# EAGLE design Arduino-Pro-v17 (EAGLE 7.7.0)
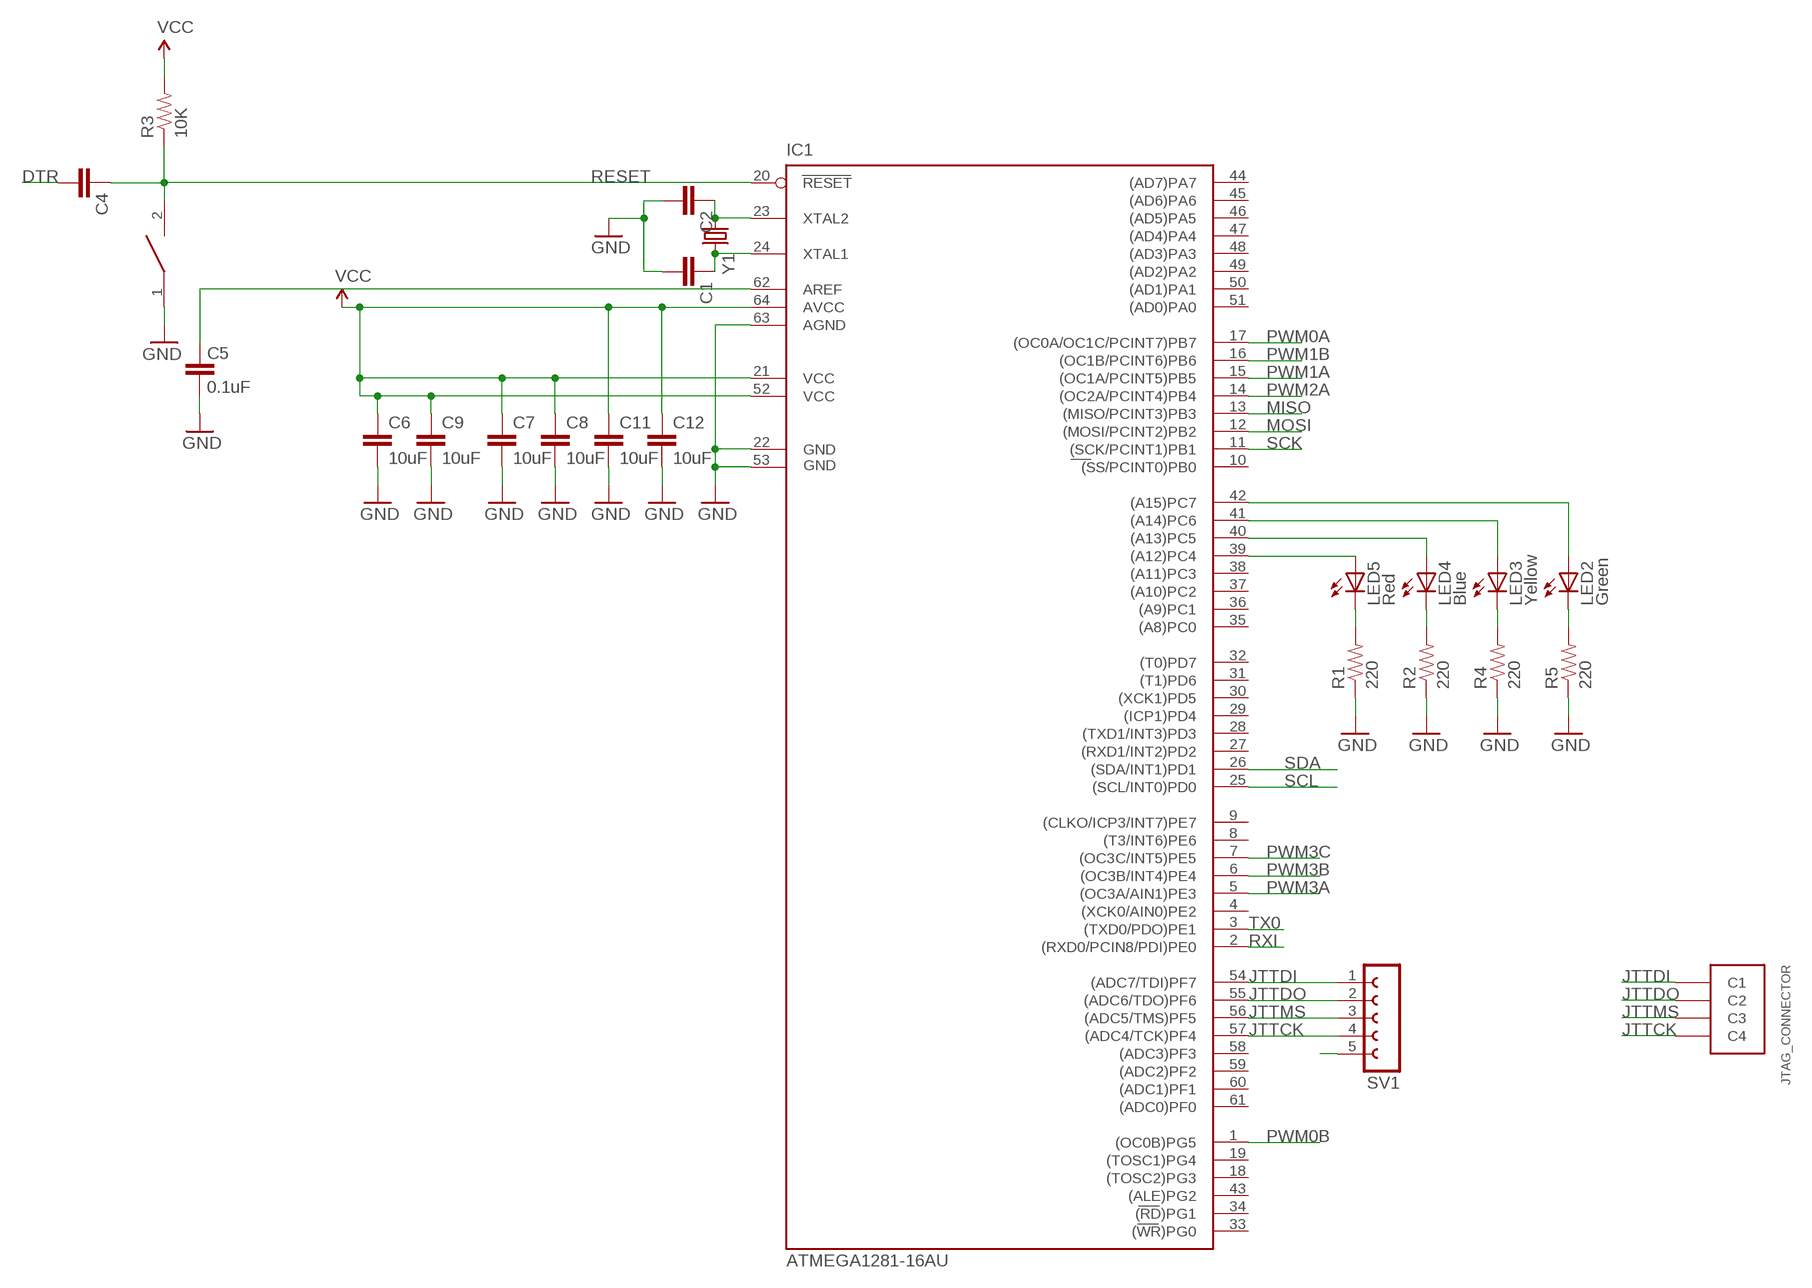
[diagram p0: schematic, sheet 1, part 1 of 2]
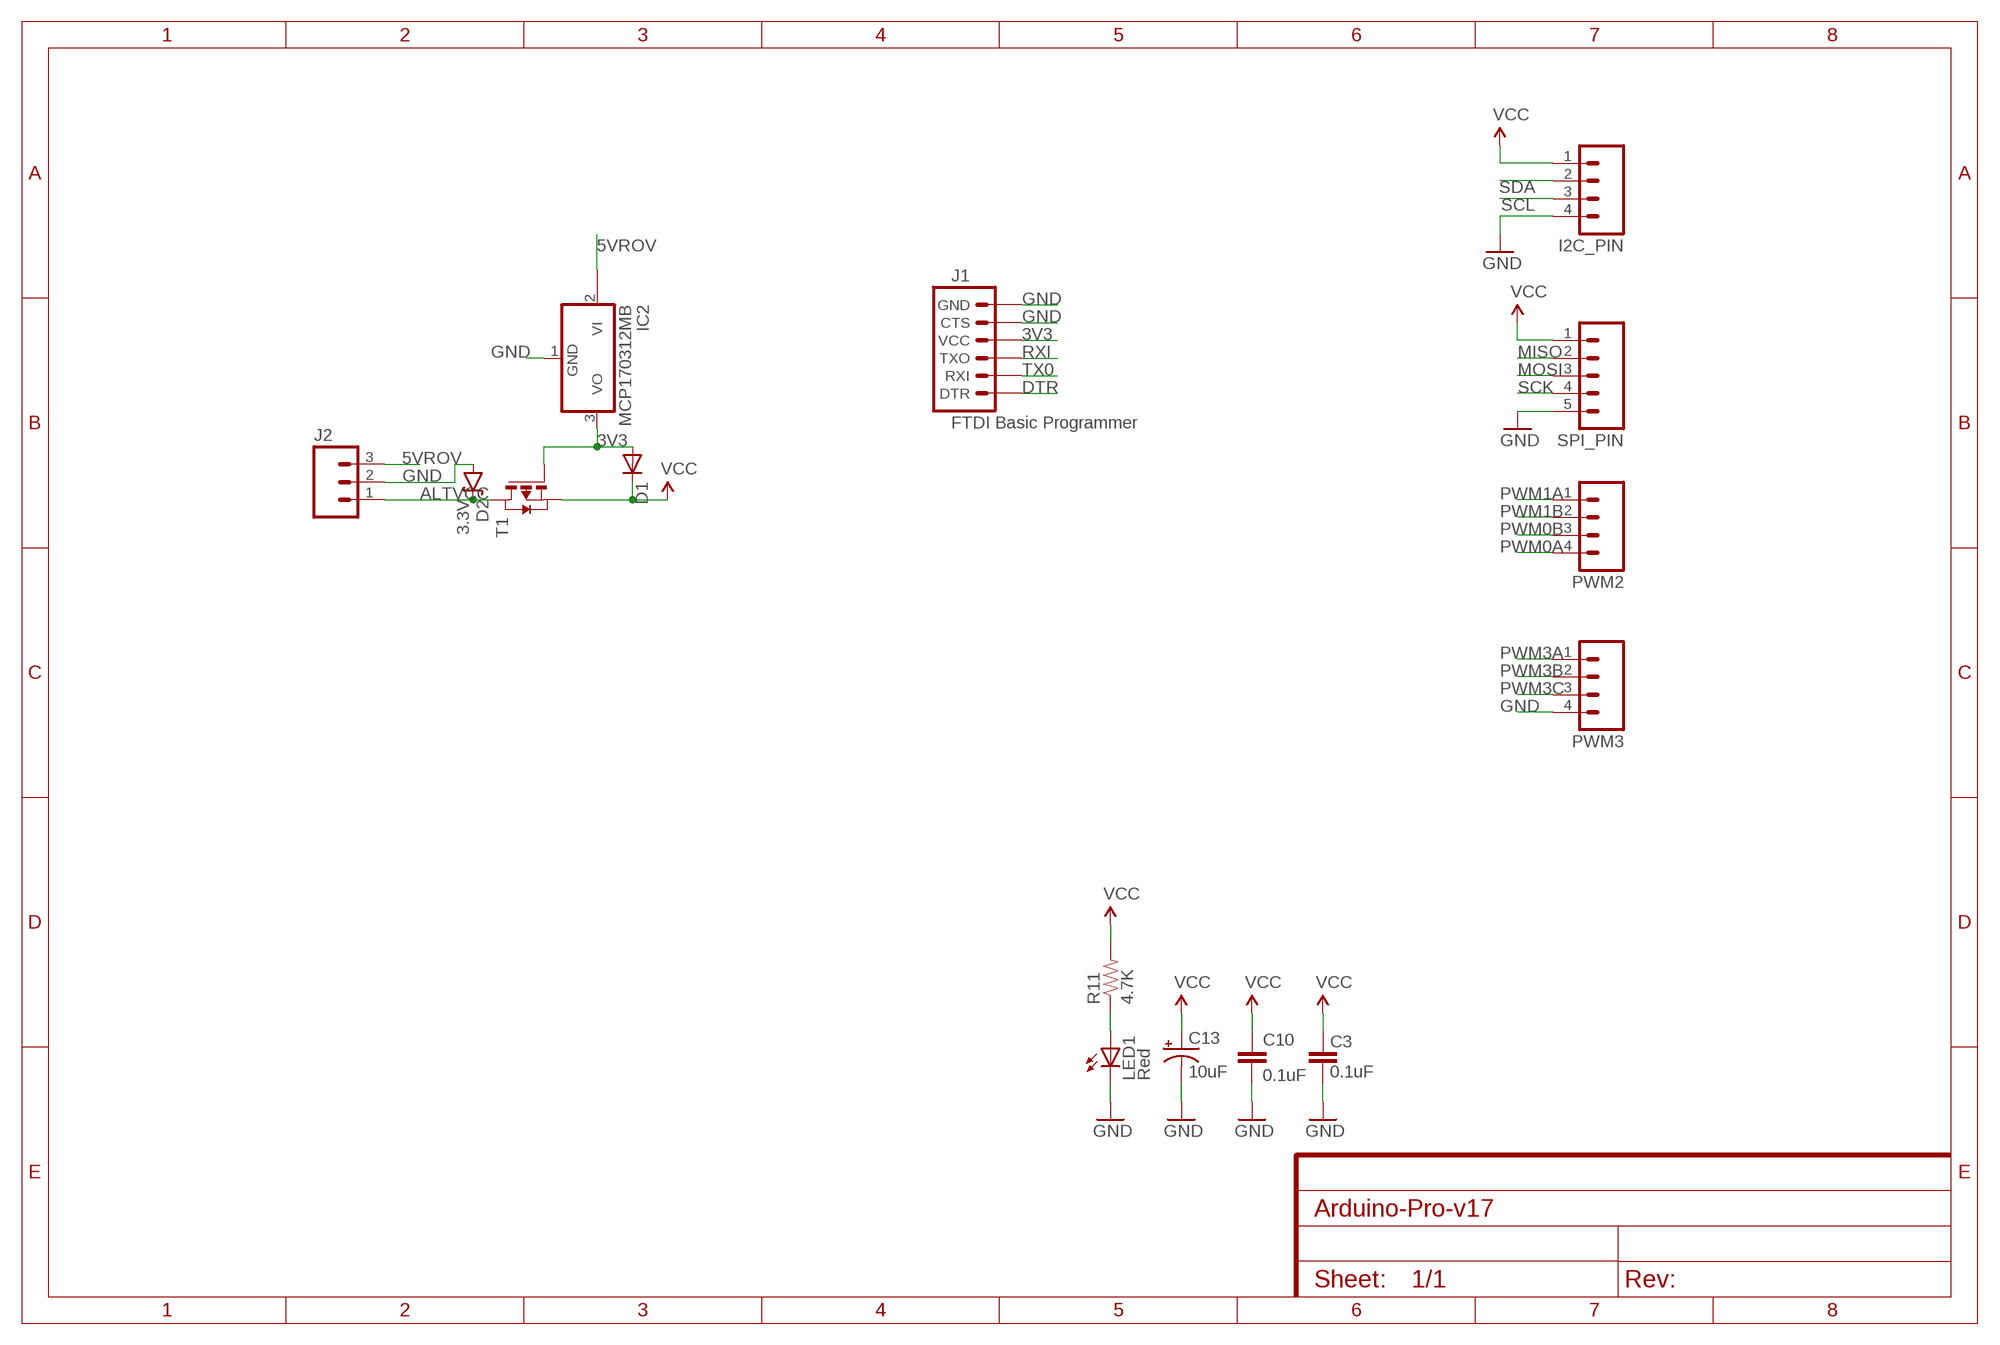
[diagram p1: schematic, sheet 1, part 2 of 2]

## Parts
C1  CAP0603-CAP  [0603-CAP]
C2  CAP0603-CAP  [0603-CAP]
C3  0.1uF  CAP0402-CAP  [0402-CAP]
C4  CAP0603-CAP  [0603-CAP]
C5  0.1uF  CAP0402-CAP  [0402-CAP]
C6  10uF  CAP0603-CAP  [0603-CAP]
C7  10uF  CAP0603-CAP  [0603-CAP]
C8  10uF  CAP0603-CAP  [0603-CAP]
C9  10uF  CAP0603-CAP  [0603-CAP]
C10  0.1uF  CAP0402-CAP  [0402-CAP]
C11  10uF  CAP0603-CAP  [0603-CAP]
C12  10uF  CAP0603-CAP  [0603-CAP]
C13  10uF  CAP_POL1206  [EIA3216]
D1  DIODE-DO-214AC  [DO-214AC]
D2  3.3V  DIODE-ZENER3.3V  [SOD-323]
I2C_PIN  M04PTH  [1X04]
IC1  ATMEGA1281-16AU  [TQFP64]
IC2  MCP170312MB  [SOT89]
J1  FTDI Basic Programmer  ARDUINO_SERIAL_PROGRAMPTH  [1X06]
J2  M03PTH  [1X03]
JTAG_CONNECTOR  MICRO-FIT-4-SMD-PART  [MICRO-FIT-4-SMD]
LED1  Red  LED0603  [LED-0603]
LED2  Green  LED0603  [LED-0603]
LED3  Yellow  LED0603  [LED-0603]
LED4  Blue  LED0603  [LED-0603]
LED5  Red  LED0603  [LED-0603]
PWM2  M04PTH  [1X04]
PWM3  M04PTH  [1X04]
R1  220  RESISTOR0402-RES  [0402-RES]
R2  220  RESISTOR0402-RES  [0402-RES]
R3  10K  RESISTOR0603-RES  [0603-RES]
R4  220  RESISTOR0402-RES  [0402-RES]
R5  220  RESISTOR0402-RES  [0402-RES]
R11  4.7K  RESISTOR0402-RES  [0402-RES]
SPI_PIN  M05PTH  [1X05]
SV1  FE05-1  [FE05-1]
T1  FDN340P  [SOT-23]
U$1  SWITCH  [SW_2512]
Y1  CRYSTALHC49US  [HC49US]

## Nets
3V3: D1.A IC2.3(VO) J1.4(VCC) T1.3(G)
5VROV: IC2.2@1(VI1) J2.3
ALTVCC: D2.C J2.1 T1.1(D)
DTR: C4.2 J1.1(DTR)
GND [vcc]: C1.2 C2.2 C3.1 C5.1 C6.2 C7.2 C8.2 C9.2 C10.2 C11.2 C12.2 C13.C(-) D2.A I2C_PIN.4 IC1.22(GND) IC1.53(GND1) IC1.63(AGND) IC2.1(GND) J1.5(CTS) J1.6(GND) J2.2 LED1.C PWM3.4 R1.1 R2.1 R4.1 R5.1 SPI_PIN.5 SV1.5 U$1.1
JTTCK: IC1.57((ADC4/TCK)PF4) JTAG_CONNECTOR.C4 SV1.4
JTTDI: IC1.54((ADC7/TDI)PF7) JTAG_CONNECTOR.C1 SV1.1
JTTDO: IC1.55((ADC6/TDO)PF6) JTAG_CONNECTOR.C2 SV1.2
JTTMS: IC1.56((ADC5/TMS)PF5) JTAG_CONNECTOR.C3 SV1.3
MISO: IC1.13((MISO/PCINT3)PB3) SPI_PIN.2
MOSI: IC1.12((MOSI/PCINT2)PB2) SPI_PIN.3
N$1: C1.1 IC1.24(XTAL1) Y1.2
N$3: C2.1 IC1.23(XTAL2) Y1.1
N$5: IC1.39((A12)PC4) LED5.A
N$7: C5.2 IC1.62(AREF)
N$9: IC1.40((A13)PC5) LED4.A
N$10: IC1.41((A14)PC6) LED3.A
N$11: IC1.42((A15)PC7) LED2.A
N$14: LED5.C R1.2
N$15: LED4.C R2.2
N$16: LED3.C R4.2
N$22: LED2.C R5.2
N$38: LED1.A R11.1
PWM0A: IC1.17((OC0A/OC1C/PCINT7)PB7) PWM2.4
PWM0B: IC1.1((OC0B)PG5) PWM2.3
PWM1A: IC1.15((OC1A/PCINT5)PB5) PWM2.1
PWM1B: IC1.16((OC1B/PCINT6)PB6) PWM2.2
PWM2A: IC1.14((OC2A/PCINT4)PB4)
PWM3A: IC1.5((OC3A/AIN1)PE3) PWM3.1
PWM3B: IC1.6((OC3B/INT4)PE4) PWM3.2
PWM3C: IC1.7((OC3C/INT5)PE5) PWM3.3
RESET: C4.1 IC1.20(RESET) R3.1 U$1.2
RXI: IC1.2((RXD0/PCIN8/PDI)PE0) J1.3(TXO)
SCK: IC1.11((SCK/PCINT1)PB1) SPI_PIN.4
SCL: I2C_PIN.3 IC1.25((SCL/INT0)PD0)
SDA: I2C_PIN.2 IC1.26((SDA/INT1)PD1)
TX0: IC1.3((TXD0/PDO)PE1) J1.2(RXI)
VCC: C3.2 C6.1 C7.1 C8.1 C9.1 C10.1 C11.1 C12.1 C13.A(+) D1.C I2C_PIN.1 IC1.21(VCC) IC1.52(VCC1) IC1.64(AVCC) R3.2 R11.2 SPI_PIN.1 T1.2(S)
Unconnected: IC1.4((XCK0/AIN0)PE2) IC1.8((T3/INT6)PE6) IC1.9((CLKO/ICP3/INT7)PE7) IC1.10((SS/PCINT0)PB0) IC1.18((TOSC2)PG3) IC1.19((TOSC1)PG4) IC1.27((RXD1/INT2)PD2) IC1.28((TXD1/INT3)PD3) IC1.29((ICP1)PD4) IC1.30((XCK1)PD5) IC1.31((T1)PD6) IC1.32((T0)PD7) IC1.33((WR)PG0) IC1.34((RD)PG1) IC1.35((A8)PC0) IC1.36((A9)PC1) IC1.37((A10)PC2) IC1.38((A11)PC3) IC1.43((ALE)PG2) IC1.44((AD7)PA7) IC1.45((AD6)PA6) IC1.46((AD5)PA5) IC1.47((AD4)PA4) IC1.48((AD3)PA3) IC1.49((AD2)PA2) IC1.50((AD1)PA1) IC1.51((AD0)PA0) IC1.58((ADC3)PF3) IC1.59((ADC2)PF2) IC1.60((ADC1)PF1) IC1.61((ADC0)PF0) IC2.2(VI)

## Library data of the parts
C1 C2 C4 = SparkFun-Capacitors:CAP: Capacitor Standard 0603 ceramic capacitor, and 0.1" leaded capacitor.
C3 C5 C10 = SparkFun:CAP: Capacitor Standard 0603 ceramic capacitor, and 0.1" leaded capacitor.
C6-C9 C11 C12 = SparkFun-Passives:CAP: Capacitor Standard 0603 ceramic capacitor, and 0.1" leaded capacitor.
C13 = SparkFun:CAP_POL: Capacitor Polarized These are standard SMD and PTH capacitors. Normally 10uF, 47uF, and 100uF in electrolytic and tantalum varieties. Always verify the external diameter of the through hole cap, it varies with capacity, voltage, and manufacturer. The EIA devices should be standard.
D1 = DiscreteComponents:DIODE-: DIODE
D2 = SparkFun-DiscreteSemi:DIODE-ZENER: Zener Diode Production Part - 8199 3.4V Zener Voltage; PROD_ID: DIO-11284
I2C_PIN PWM2 PWM3 = SparkFun-Connectors:M04: Header 4 Standard 4-pin 0.1" header. Use with straight break away headers (SKU : PRT-00116), right angle break away headers (PRT-00553), swiss pins (PRT-00743), machine pins (PRT-00117), and female headers (PRT-00115). Molex polarized connector foot print use with SKU : PRT-08231 with associated crimp pins and housings. 1MM SMD Version SKU: PRT-10208; PROD_ID: CONN-09696
IC1 = atmel-2005:ATMEGA1281*: MICROCONTROLLER 128 Kbytes FLASH 4 Kbytes EEPROM 8 Kbytes SRAM 54 General Purpose I/O pins 6-channels 16-bit PWM 2 x Serial USARTs 8-channels 10-bit A/D
IC2 = linear:MCP1703*: 250 mA, 16V, Low Quiescent Current LDO Regulator Source: http://ww1.microchip.com/downloads/en/DeviceDoc/22049b.pdf
J1 = SparkFun-Connectors:ARDUINO_SERIAL_PROGRAM: FTDI connector footprints
J2 = SparkFun-Connectors:M03: Header 3 Standard 3-pin 0.1" header. Use with straight break away headers (SKU : PRT-00116), right angle break away headers (PRT-00553), swiss pins (PRT-00743), machine pins (PRT-00117), and female headers (PRT-00115). Molex polarized connector foot print use with SKU : PRT-08232 with associated crimp pins and housings.
JTAG_CONNECTOR = Connectors:MICRO-FIT-4-SMD: 4 Pin Molex connector; DIGIKEY-CONTACT-PN: WM1125CT-ND; DIGIKEY-FEMALE-PN: WM2640CT-ND; DIGIKEY-MALE-PN: WM1847-ND
LED1-LED5 = SparkFun:LED: LEDs Standard schematic elements and footprints for 5mm, 3mm, 1206, and 0603 sized LEDs. 5mm - Spark Fun Electronics SKU : COM-00529 (and others)
R1 R2 R4 R5 R11 = SparkFun:RESISTOR: Resistor Basic schematic elements and footprints for 0603, 1206, and PTH resistors.
R3 = SparkFun-Passives:RESISTOR: Resistor Basic schematic elements and footprints for 0603, 1206, and PTH resistors.
SPI_PIN = SparkFun-Connectors:M05: Header 5 Standard 5-pin 0.1" header. Use with straight break away headers (SKU : PRT-00116), right angle break away headers (PRT-00553), swiss pins (PRT-00743), machine pins (PRT-00117), and female headers (PRT-00115). Molex polarized connector foot print use with SKU : PRT-08230 with associated crimp pins and housings.
SV1 = con-lsta:FE05-1: FEMALE HEADER; OC_FARNELL: unknown; OC_NEWARK: unknown
T1 = DiscreteComponents:FDN340P: MOS FET; DIGIKEY: FDN340PCT-ND
U$1 = DiscreteComponents:SWITCH
Y1 = SparkFun-FreqCtrl:CRYSTAL: Various standard crystals. Proven footprints.

## Net classes
0 default: width 0.203 mm
1 vcc: width 0.254 mm

## Board
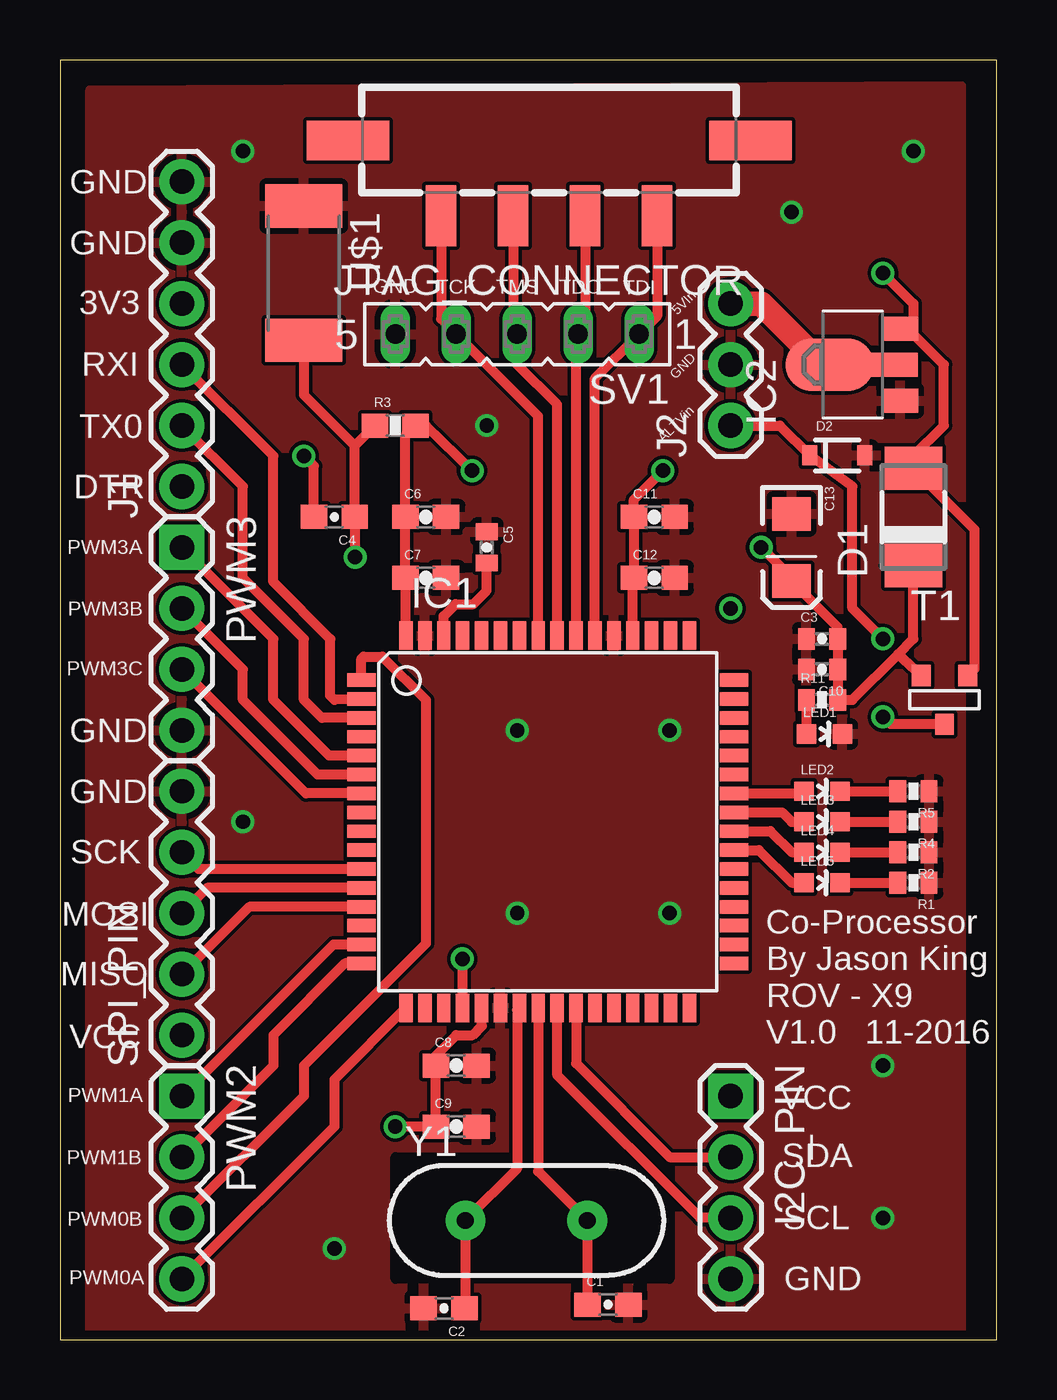
[diagram p2: board, top side]
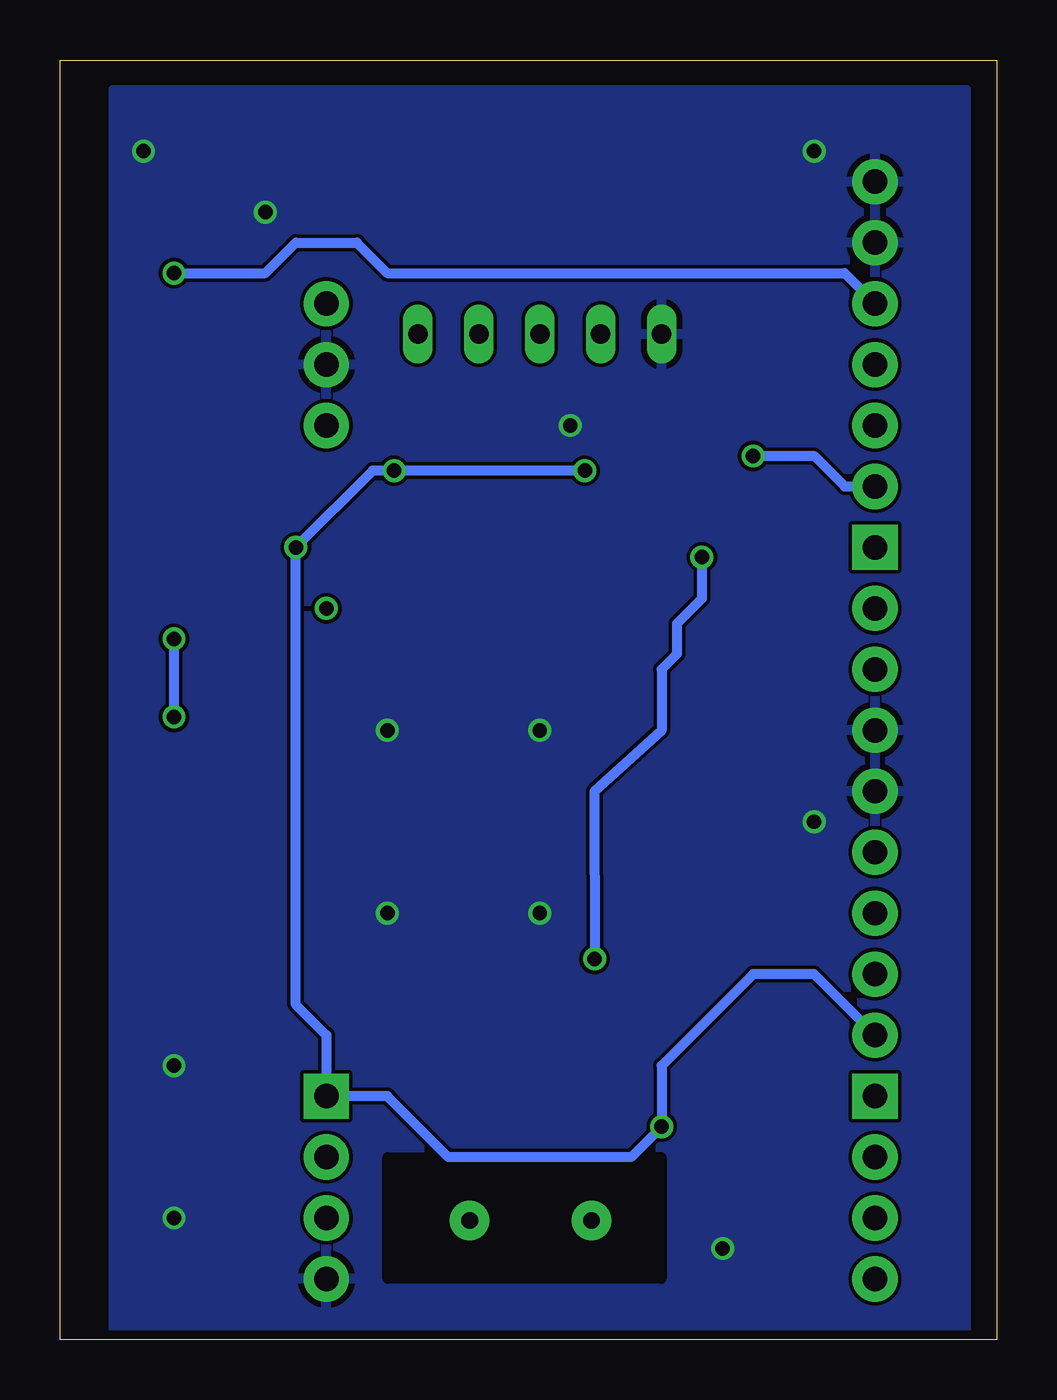
[diagram p3: board, bottom side, seen from below]

Size 39.04 x 53.33 mm. Coordinates in mm from the lower left corner, seen from the top.
Outline: 0,0 39.04,0 39.04,53.33 0,53.33 0,0
Copper layers (1*16): Top 0.0356mm / dielectric 1.5011mm / Bottom 0.0356mm
Design rules "LaenPCBOrder": minimum track width 6mil, minimum drill 13mil, track to track 6mil, track to pad 6mil, pad to pad 6mil, via to via 6mil, smd to smd 6mil, copper to edge 15mil, drill to drill 6mil, minimum pad ring 7mil, minimum via ring 7mil, stop-mask expansion 3mil, vias tented up to drill 0mil, thermal gap 10mil
tRestrict: area 14,2.5 to 25.4,7.6
bRestrict: area 14,2.5 to 25.4,7.6

### Footprints (pad centres in the part's own frame; a part is rotated, then mirrored left to right if it is on the bottom)
0603-CAP = smd 1.1 x 1: 1 -0.85,0; 2 0.85,0
0402-CAP = smd 0.7 x 0.9: 1 -0.65,0; 2 0.65,0
EIA3216 = smd 1.4 x 1.6: A 1.4,0; C -1.4,0
DO-214AC = smd 1.8 x 2.4: A 2.025,0; C -2.025,0
SOD-323 = smd 0.63 x 0.83: A 1.15,0; C -1.15,0
1X04 = drill 1.016 pad 1.88 square: 1 0,0 | drill 1.016 pad 1.88: 2 2.54,0; 3 5.08,0; 4 7.62,0
TQFP64 = smd 1.194 x 0.559: 1 -7.76,5.905; 2 -7.76,5.118; 3 -7.76,4.331; 4 -7.76,3.543; 5 -7.76,2.756; 6 -7.76,1.968; 7 -7.76,1.181; 8 -7.76,0.394; 9 -7.76,-0.394; 10 -7.76,-1.181; 11 -7.76,-1.968; 12 -7.76,-2.756; 13 -7.76,-3.543; 14 -7.76,-4.331; 15 -7.76,-5.118; 16 -7.76,-5.905; 33 7.76,-5.905; 34 7.76,-5.118; 35 7.76,-4.331; 36 7.76,-3.543; 37 7.76,-2.756; 38 7.76,-1.968; 39 7.76,-1.181; 40 7.76,-0.394; 41 7.76,0.394; 42 7.76,1.181; 43 7.76,1.968; 44 7.76,2.756; 45 7.76,3.543; 46 7.76,4.331; 47 7.76,5.118; 48 7.76,5.905 | smd 0.559 x 1.194: 17 -5.905,-7.76; 18 -5.118,-7.76; 19 -4.331,-7.76; 20 -3.543,-7.76; 21 -2.756,-7.76; 22 -1.968,-7.76; 23 -1.181,-7.76; 24 -0.394,-7.76; 25 0.394,-7.76; 26 1.181,-7.76; 27 1.968,-7.76; 28 2.756,-7.76; 29 3.543,-7.76; 30 4.331,-7.76; 31 5.118,-7.76; 32 5.905,-7.76; 49 5.905,7.76; 50 5.118,7.76; 51 4.331,7.76; 52 3.543,7.76; 53 2.756,7.76; 54 1.968,7.76; 55 1.181,7.76; 56 0.394,7.76; 57 -0.394,7.76; 58 -1.181,7.76; 59 -1.968,7.76; 60 -2.756,7.76; 61 -3.543,7.76; 62 -4.331,7.76; 63 -5.118,7.76; 64 -5.905,7.76
SOT89 = smd 1 x 1.5: 1 -1.499,-1.981; 3 1.499,-1.981 | smd 1 x 2: 2 0,-1.727 | smd 2.2 x 3.7: 2@1 0,0.94
1X06 = drill 1.016 pad 1.88: 1 0,0; 2 2.54,0; 3 5.08,0; 4 7.62,0; 5 10.16,0; 6 12.7,0
1X03 = drill 1.016 pad 1.88: 1 0,0; 2 2.54,0; 3 5.08,0
MICRO-FIT-4-SMD = smd 1.27 x 2.54: C1 5.6,3.955; C2 8.6,3.955; C3 11.6,3.955; C4 14.6,3.955 | smd 3.43 x 1.65: NC1 1.715,0.825; NC2 18.485,0.825
LED-0603 = smd 0.8 x 0.8: A 0,-0.75; C 0,0.75
0402-RES = smd 0.7 x 0.9: 1 -0.65,0; 2 0.65,0
0603-RES = smd 1.1 x 1: 1 -0.85,0; 2 0.85,0
1X05 = drill 1.016 pad 1.88: 1 0,0; 2 2.54,0; 3 5.08,0; 4 7.62,0; 5 10.16,0
FE05-1 = drill 0.813 long: 1 -5.08,0; 2 -2.54,0; 3 0,0; 4 2.54,0; 5 5.08,0
SOT-23 = smd 0.787 x 0.889: 1 0.025,-1.016; 2 -0.94,1.016; 3 0.991,1.016
SW_2512 = smd 1.8 x 3.2: 1 -2.8,0; 2 2.8,0
HC49US = drill 0.7 pad 1.651: 1 -2.54,0; 2 2.54,0

### Placement (x,y rotation side)
C1  22.83,1.47 0 top
C2  16,1.32 180 top
C3  31.75,29.21 0 top
C4  11.43,34.29 180 top
C5  17.78,33.02 270 top
C6  15.24,34.29 0 top
C7  15.24,31.75 0 top
C8  16.51,11.43 0 top
C9  16.51,8.89 0 top
C10  31.75,27.94 180 top
C11  24.77,34.29 0 top
C12  24.77,31.75 0 top
C13  30.48,33.02 270 top
D1  35.56,34.29 90 top
D2  32.38,36.86 0 top
I2C_PIN  27.94,10.16 270 top
IC1  20.32,21.59 0 top
IC2  33.02,40.64 90 top
J1  5.08,35.56 90 top
J2  27.94,38.1 90 top
JTAG_CONNECTOR  30.48,50.8 180 top
LED1  31.85,25.25 270 top
LED2  31.75,22.86 270 top
LED3  31.75,21.59 270 top
LED4  31.75,20.32 270 top
LED5  31.75,19.05 270 top
PWM2  5.08,10.16 270 top
PWM3  5.08,33.02 270 top
R1  35.56,19.05 180 top
R2  35.56,20.32 180 top
R3  13.97,38.1 0 top
R4  35.56,21.59 180 top
R5  35.56,22.86 180 top
R11  31.75,26.67 0 top
SPI_PIN  5.08,12.7 90 top
SV1  19.05,41.91 180 top
T1  36.83,26.67 0 top
U$1  10.16,44.45 270 top
Y1  19.43,4.98 0 top

### Tracks (layer width: path | path; a pad name or v marks a point on that pad's centre or on a via)
3V3  (via drill 0.6 pad 0.51)
  Top 0.406: D1.A 35.05,36.31 | 35.56,41.91 36.83,40.64 36.83,38.1 35.56,36.83 D1.A | 35.56,41.91 35.23,41.91 IC2.3 | v34.29,44.45 35.56,43.18 35.56,41.91 | D1.A 38.1,33.78 38.1,27.96 T1.3
  Bottom 0.406: J1.4 6.35,44.45 25.4,44.45 26.67,45.72 29.21,45.72 30.48,44.45 v34.29,44.45
5VROV
  Top 1.016: J2.3 29.21,43.18 31.75,40.64 IC2.2@1 33.02,40.64
ALTVCC  (via drill 0.6 pad 0.51)
  Top 0.406: J2.1 29.99,38.1 D2.C 33.02,35.56 33.02,30.48 v34.29,29.21 | T1.1 34.59,25.65 v34.29,25.96
  Bottom 0.406: v34.29,25.96 v34.29,29.21
DTR  (via drill 0.6 pad 0.51)
  Top 0.406: C4.2 10.58,36.41 v10.16,36.83
  Bottom 0.406: v10.16,36.83 7.62,36.83 6.35,35.56 J1.1
GND  (via drill 0.6 pad 0.51)
  other vias: 19.05,25.4 7.62,21.59 25.4,25.4 34.29,5.08 17.78,38.1 35.56,49.53 30.48,46.99 7.62,49.53 11.43,3.81 34.29,11.43 25.4,17.78 19.05,17.78
  pour Top: 1.27,52.07 37.54,52.25 37.54,0.18 1.27,0
  pour Bottom: 1.27,52.07 36.83,52.07 36.83,0 1.27,0
JTTCK
  Top 0.406: JTAG_CONNECTOR.C4 15.88,42.54 SV1.4 19.93,38.49 IC1.57
JTTDI
  Top 0.406: JTAG_CONNECTOR.C1 24.88,42.66 SV1.1 22.29,40.07 IC1.54
JTTDO
  Top 0.406: JTAG_CONNECTOR.C2 21.88,42.2 SV1.2 21.5,41.82 IC1.55
JTTMS
  Top 0.406: JTAG_CONNECTOR.C3 18.88,42.08 SV1.3 19.05,40.64 20.71,38.98 IC1.56
MISO
  Top 0.406: IC1.13 7.89,18.05 SPI_PIN.2
MOSI
  Top 0.406: IC1.12 6.13,18.83 SPI_PIN.3
N$1
  Top 0.406: IC1.24 19.93,7.02 Y1.2 21.97,1.49 C1.1
N$2  (via drill 0.6 pad 0.51)
  other vias: 27.94,30.48
N$3
  Top 0.406: IC1.23 19.05,13.74 19.05,7.14 Y1.1 16.89,1.36 C2.1
N$5
  Top 0.406: IC1.39 29.12,20.41 30.48,19.05 LED5.A
N$7
  Top 0.406: IC1.62 15.99,30.16 16.48,30.66 17.22,30.66 17.78,31.22 C5.2
N$9
  Top 0.406: IC1.40 29.6,21.2 30.48,20.32 LED4.A
N$10
  Top 0.406: IC1.41 30.09,21.98 30.48,21.59 LED3.A
N$11
  Top 0.406: IC1.42 30.91,22.77 LED2.A
N$14
  Top 0.406: LED5.C R1.2
N$15
  Top 0.406: LED4.C R2.2
N$16
  Top 0.406: LED3.C R4.2
N$22
  Top 0.406: LED2.C R5.2
N$38
  Top 0.406: R11.1 LED1.A
PWM0A
  Top 0.406: IC1.17 11.43,10.85 11.43,8.89 PWM2.4
PWM0B
  Top 0.406: IC1.1 12.56,28.38 12.65,28.47 13.44,28.47 15.24,26.67 15.24,16.51 10.16,11.43 10.16,10.16 PWM2.3
PWM1A
  Top 0.406: IC1.15 11.39,16.47 PWM2.1
PWM1B
  Top 0.406: IC1.16 11.88,15.68 8.89,12.7 8.89,11.43 PWM2.2
PWM3A
  Top 0.406: IC1.5 11.21,24.35 8.89,26.67 8.89,29.21 PWM3.1
PWM3B
  Top 0.406: IC1.6 10.73,23.56 7.62,26.67 7.62,27.94 PWM3.2
PWM3C
  Top 0.406: IC1.7 10.25,22.77 PWM3.3
RESET  (via drill 0.6 pad 0.51)
  Top 0.406: 12.28,37.26 C4.1 12.29,34.28 v12.29,32.61 | 12.28,37.26 R3.1 | U$1.2 10.16,39.38 12.28,37.26 | v16.76,15.88 16.76,13.84 IC1.20
  Bottom 0.406: v16.76,15.88 16.78,22.86 13.97,25.4 13.97,27.94 13.34,28.57 13.34,29.85 12.28,30.9 v12.28,32.6 v12.29,32.61
RXI
  Top 0.406: IC1.2 11.43,26.67 11.25,26.85 11.27,29.2 8.89,31.58 8.89,36.83 J1.3
SCK
  Top 0.406: IC1.11 5.78,19.62 SPI_PIN.4
SCL
  Top 0.406: I2C_PIN.3 26.67,5.08 20.73,11.02 20.73,13.82 IC1.25
SDA
  Top 0.406: IC1.26 21.5,11.52 25.4,7.62 I2C_PIN.2
TX0
  Top 0.406: IC1.3 10.91,25.92 10.16,26.67 10.16,29.21 7.62,31.75 7.62,35.56 J1.2
VCC  (via drill 0.6 pad 0.51)
  Top 0.406: 34.46,32.27 D1.C 35.56,29.21 34.92,28.57 | IC1.64 14.41,31.72 C7.1 C6.1 14.39,37.67 R3.2 15.24,38.1 v17.17,36.22 | IC1.52 23.86,31.7 C12.1 C11.1 23.91,35.02 v25.12,36.22 | IC1.21 17.58,13.82 17.58,13.08 17.2,12.7 16.51,12.7 15.66,11.85 C8.1 C9.1 v13.97,8.89 | v29.21,33.02 30.48,31.75 C13.A 32.4,29.7 C3.2 C10.1 R11.2 33.02,26.67 34.92,28.57 | T1.2 34.92,28.57
  Bottom 0.406: v17.17,36.22 v25.12,36.22 26.01,36.22 v29.21,33.02 29.21,13.97 27.94,12.7 I2C_PIN.1 25.4,10.16 22.86,7.62 15.24,7.62 v13.97,8.89 13.97,11.43 10.16,15.24 7.62,15.24 SPI_PIN.1

### Text on the board
tPlace: GND | GND | GND | TCK | TMS | TDO | TDI | 3V3 | 5VIn | RXI | GND | TX0 | ALTVin | DTR | PWM3A | PWM3B | PWM3C | GND | GND | SCK | MOSI | MISO | VCC | Co-Processor / By Jason King / ROV - X9 / V1.0 11-2016 | PWM1A | VCC | PWM1B | SDA | PWM0B | SCL | PWM0A | GND